# Altium schematic sheet 7_PRECHARGE.chDoc.SchDoc
size A4; SheetNumber: 7; SheetTotal: 7
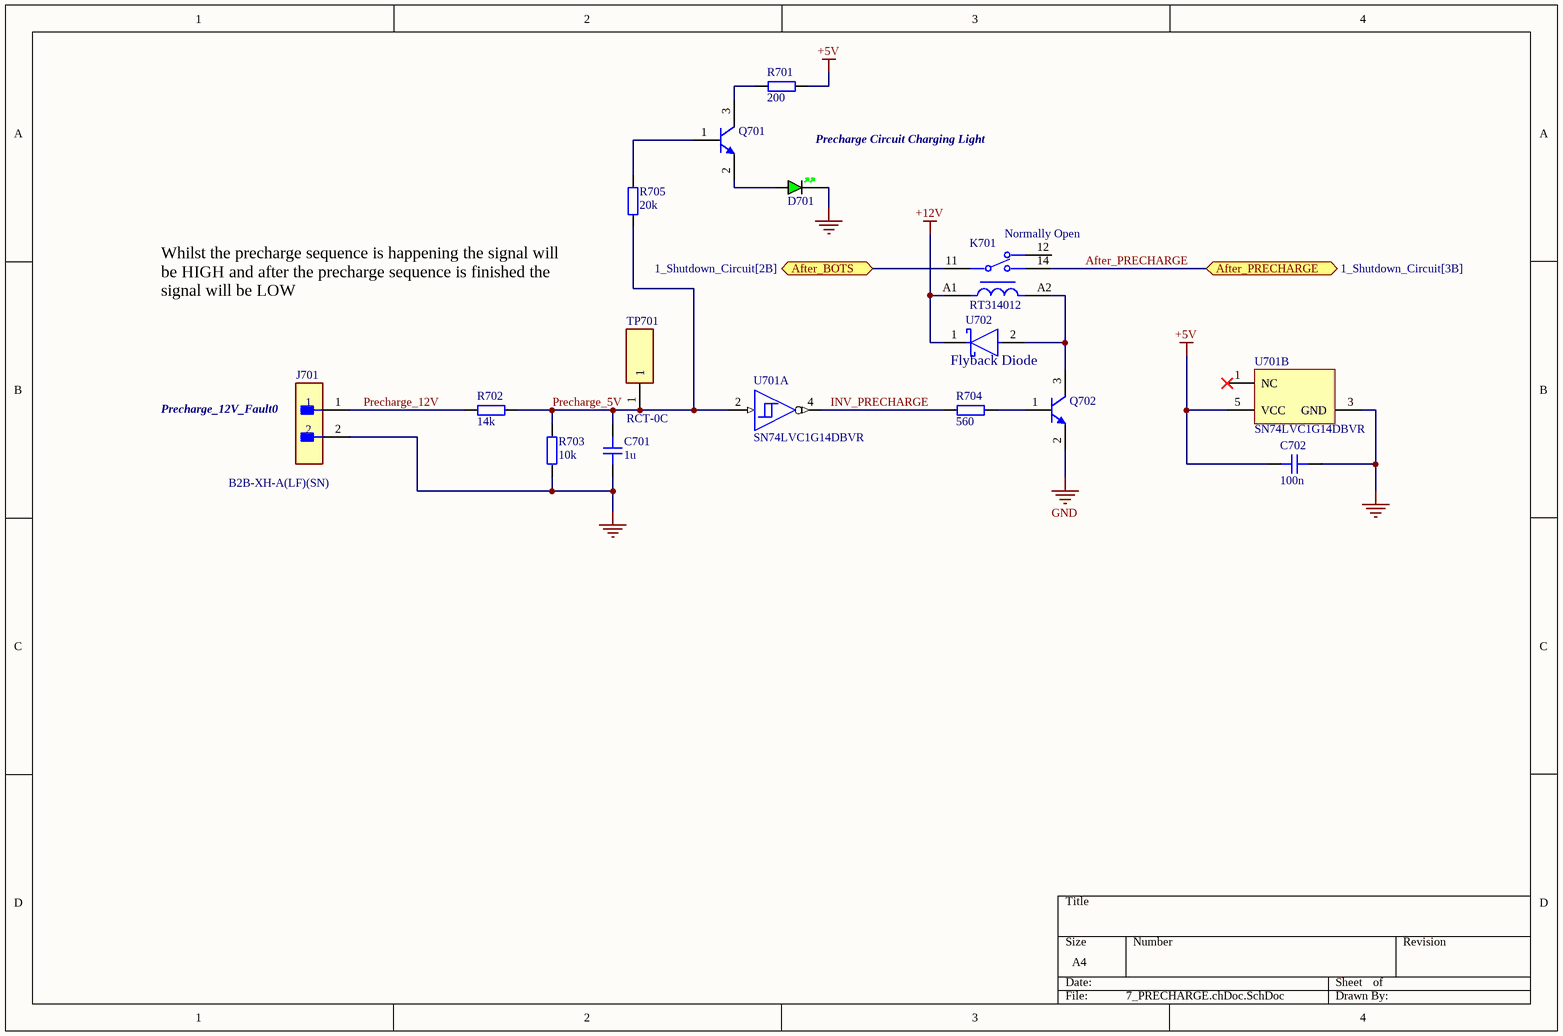
[diagram p0: 7_PRECHARGE.chDoc.SchDoc]

## Parts
C701  1u  [CAP_0805]
C702  100n  [CAP_0805]
D701  GREEN  [LED_0805_GREEN]  (value not drawn)
J701  B2B-XH-A(LF)(SN)  [FP-B2B-XH-A_LF_SN-MFG]
K701  RT314012  [FP-RT314012-MFG]
Q701  MMBT5550LT1G  [ONSC-SOT-23-3-318-08_V]  (value not drawn)
Q702  MMBT5550LT1G  [ONSC-SOT-23-3-318-08_V]  (value not drawn)
R701  200  [RES_0805]
R702  14k  [RES_0805]
R703  10k  [RES_0805]
R704  560  [RES_0805]
R705  20k  [RES_0805]
TP701  RCT-0C  [RCT-0C]
U701  SN74LVC1G14DBVR  [DBV0005A_L]  (parts A,B of 2)
U702  BAT54JFILM  [FP-SOD323-MFG]  (value not drawn)

## Ports
After_BOTS (bidir, see 1_Shutdown_Circuit[2B]), After_PRECHARGE (bidir, see 1_Shutdown_Circuit[3B])

## Nets
+5V: C702.2 R701.2 U701.5(VCC)
+12V: K701.A1 U702.1(C)
GND: C701.1 C702.1 D701.K J701.2 Q702.2(E) R703.1 U701.3(GND)
After_BOTS: K701.11 ; port After_BOTS
After_PRECHARGE: K701.14 ; port After_PRECHARGE
INV_PRECHARGE: R704.1 U701.4(Y)
Precharge_5V: C701.2 R702.2 R703.2 R705.2 TP701.1 U701.2(A)
Precharge_12V: J701.1 R702.1
NetD701_A: D701.A Q701.2(E)
NetK701_A2: K701.A2 Q702.3(C) U702.2(A)
NetQ701_1: Q701.1(B) R705.1
NetQ701_3: Q701.3(C) R701.1
NetQ702_1: Q702.1(B) R704.2

Not connected (* = marked no-connect by the designer): K701 12; U701 1(NC)*

## Notes on the sheet
- Precharge Circuit Charging Light
- (near K701) Normally Open
- Whilst the precharge sequence is happening the signal will be HIGH and after the precharge sequence is finished the signal will be LOW
- (near U702) Flyback Diode
- (near J701) Precharge_12V_Fault0

## Library data of the parts
C701 C702 = CAP_0805: Capacitor SMD 0805; Manufacturer: *; Manufacturer Part Number: *; Distributor Link: *; LCSC: *; Rating: *; Dielectric: *
D701 = LED_0805_GREEN: LED 0805 GREEN SMD; Manufacturer: *; Manufacturer Part Number: *; Distributor Link: *; LCSC: *
J701 = CMP-2000-05888-3: CONN HEADER VERT 2POS 2.5MM; Current Rating: 3A; Voltage Rating: 250V; Number of Contacts: 2; Contact Resistance: 20mR; Wire/Cable Gauge: 22AWG; Insulation Resistance: 1GR; Connector Type: Male Pin; Packaging: Bulk; Contact Material: Brass; Lead Free: Lead Free; Orientation: Straight; Contact Plating: Tin; Max Current Rating: 3A; Termination: Solder; Fastening Type: Detent; Depth: 5.75mm; Housing Material: Polyamide; REACH SVHC: No SVHC; Series: XH; Voltage Rating (AC): 250V; Number of Positions: 2; Color: Natural; Contact Type: Male Pin; Max Voltage Rating (DC): 250V; Pitch: 2.5mm; Lead Pitch: 2.5mm; Mount: Through Hole; Max Operating Temperature: 85°C; Length: 7.4mm; Max Voltage Rating (AC): 250V; Min Operating Temperature: -25°C; Number of Rows: 1; Housing Color: White
K701 = CMP-03395-000105-1: RELAY GEN PURPOSE SPDT 16A 12V; Manufacturer: TE Connectivity; Coil Type: Non-Latching; Number Of Contacts: 1; Coil Power: 400mW; Coil Resistance: 360Ω; Device Class L2: Relays; Digikey Description: RELAY GEN PURPOSE SPDT 16A 12V; Coil Voltage: 12V; RoHS: TRUE; Category: Relay; Lead Free: Yes; Manufacturer Part Number: RT314012; ComponentLink2Description: Datasheet; Throw Configuration: SPDT; Current Rating: 16A; Ambient Temperature Range Low: -40°C; ComponentLink2URL: https://www.te.com/commerce/DocumentDelivery/DDEController?Action=showdoc&DocId=Data+Sheet%7FRT1%7F0219%7Fpdf%7FEnglish%7FENG_DS_RT1_0219.pdf%7F9-1393239-5; Automotive: No; Device Class L1: Electromechanical; Octopart: https://octopart.com/9-1393239-5-te+connectivity-46509288; Ambient Temperature Range High: +85°C; Height: 15.7mm; Package: RT314012; Device Class L3: Power Relays
Q701 Q702 = CMP-1048-00659-1: High Voltage Transistor, NPN Silicon, 3-Pin SOT-23, Pb-Free, Tape and Reel; Manufacturer: On Semiconductor; IC Continuous (A): 0.6; PackageDescription: 3-Pin Small Outline Transistor, Body 2.92 x 1.3 mm, Pitch 0.95 mm; ComponentLink3URL: http://www.onsemi.cn/pub_link/Collateral/318-08.PDF; RoHS: TRUE; ComponentLink2URL: http://www.onsemi.cn/pub_link/Collateral/MMBT5550LT1-D.PDF; DatasheetVersion: Rev. 10; ComponentLink1URL: http://www.onsemi.com/; PackageReference: SOT-23-3-318-08; PackageVersion: Rev. AP, 11/2009; Mounting Technology: Surface Mount; ComponentLink2Description: Datasheet; PartNumber: MMBT5550LT1G; ComponentLink3Description: Package Specification; Packing: Tape and Reel; Polarity: NPN; ComponentLink1Description: Manufacturer URL
R701-R705 = RES_0805: Resistor SMD 0805; Manufacturer: *; Manufacturer Part Number: *; Distributor Link: *; LCSC: *
TP701 = RCT-0C: Test Point; Manufacturer_Name: TE Connectivity; Datasheet Link: https://www.te.com/commerce/DocumentDelivery/DDEController?Action=srchrtrv&DocNm=1773266&DocType=Data%20Sheet&DocLang=English&PartCntxt=1625854-2&DocFormat=pdf; Manufacturer_Part_Number: RCT-0C; Mouser Part Number: 279-RCT-0C; Mouser Price/Stock: https://www.mouser.co.uk/ProductDetail/TE-Connectivity-Holsworthy/RCT-0C?qs=ip69W3eHERWzZOsRKmFYAw%3D%3D; Arrow Part Number: RCT-0C; Arrow Price/Stock: https://www.arrow.com/en/products/rct-0c/te-connectivity?region=nac
U701 = CMP-0859-00030-4: Single Schmitt-Trigger Inverter, DBV0005A, LARGE T&R; Manufacturer: Texas Instruments; Input Type: CMOS/TTL; Output Drive (IOL/IOH)(Max)(mA): 32/-32; VCC(Min)(V): 1.65; 3-State Output: No; Schmitt Trigger: Yes; tpd @ Nom Voltage(Max)(ns): 11,6.5,5.5,5; VCC(Max)(V): 5.5; Output Type: CMOS; Bits(#): 1; Voltage(Nom)(V): 1.8,2.5,3.3,5; Sub-Family: Inverting Buffer/Driver; Logic: Inverting; Technology Family: LVC; F @ Nom Voltage(Max)(Mhz): 150; Rating: Catalog; ICC @ Nom Voltage(Max)(mA): 0.01; DatasheetVersion: SCES218W; PackageReference: DBV0005A; Generic Part Number: SN74LVC1G14; Operating Temperature Range(C): -40 to 125,-40 to 85
U702 = CMP-2000-05927-2: DIODE SCHOTTKY 40V 300MA SOD323; Manufacturer: STMicroelectronics; Max Surge Forward Current: 1.25A; Value: 7pF; Max Junction Temp: +150°C; Peak Reverse Current: 1uA; Standoff Height: 0mm; ComponentLink2Description: Datasheet; Device Class L2: Diodes; Mouser Description: Schottky Diodes & Rectifiers 300mA 40 Volt; Forward Current: 300mA; Temperature Range Low: -40°C; Temperature Range High: +150°C; Digikey Description: DIODE SCHOTTKY 40V 300MA SOD323; Capacitance: 7pF; Ipc Land Pattern Name: SOD250128X117-2; Automotive: No; Manufacturer Part Number: BAT54JFILM; Device Class L1: Discrete Semiconductors; Lead Free: Yes; ComponentLink2URL: https://www.st.com/resource/en/datasheet/bat54.pdf; Package: SOD323; Temperature: -40°C to +150°C; Category: IC; Height: 1.17mm; Octopart: https://octopart.com/bat54jfilm-stmicroelectronics-326073; RoHS: TRUE; Device Class L3: Schottky Diodes; Max Repetitive Reverse Voltage: 40V